# EAGLE design bluenrg-m2sa-to-dip (EAGLE 9.4.2)
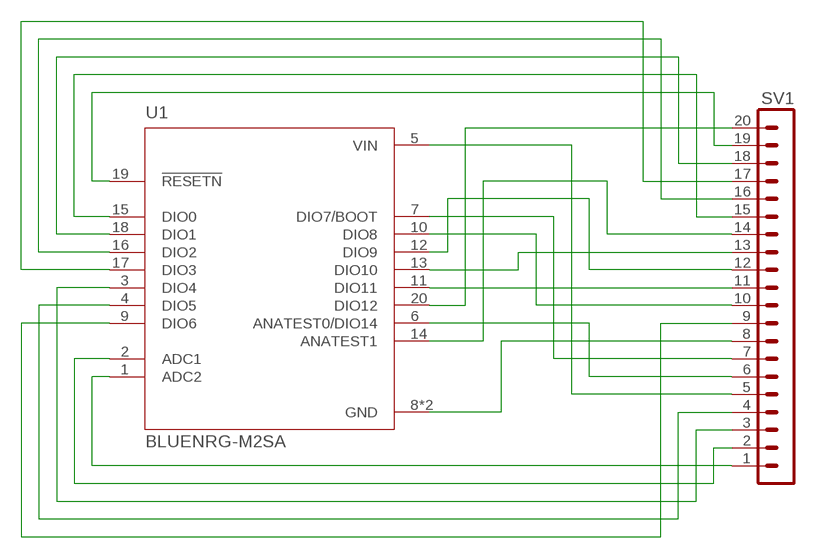
[diagram p0: schematic, sheet 1]

## Parts
SV1  MA20-1  [MA20-1]
U1  BLUENRG-M2SA  [XCVR_BLUENRG-M2SA]

## Nets
ADC1: SV1.2 U1.2(ADC1)
ADC2: SV1.1 U1.1(ADC2)
ANATEST0/DIO14: SV1.6 U1.6(ANATEST0/DIO14)
ANATEST1: SV1.14 U1.14(ANATEST1)
DIO0: SV1.15 U1.15(DIO0)
DIO1: SV1.18 U1.18(DIO1)
DIO2: SV1.16 U1.16(DIO2)
DIO3: SV1.17 U1.17(DIO3)
DIO4: SV1.3 U1.3(DIO4)
DIO5: SV1.4 U1.4(DIO5)
DIO6: SV1.9 U1.9(DIO6)
DIO7/BOOT: SV1.7 U1.7(DIO7/BOOT)
DIO8: SV1.10 U1.10(DIO8)
DIO9: SV1.12 U1.12(DIO9)
DIO10: SV1.13 U1.13(DIO10)
DIO11: SV1.11 U1.11(DIO11)
DIO12: SV1.20 U1.20(DIO12)
GND: SV1.8 U1.8(GND) U1.21(GND)
RESETN: SV1.19 U1.19(!RESETN)
VIN: SV1.5 U1.5(VIN)

## Library data of the parts
SV1 = con-lstb:MA20-1: PIN HEADER; OC_FARNELL: unknown; OC_NEWARK: unknown
U1 = BLUENRG-M2SA:BLUENRG-M2SA: Very low power application processor module for Bluetooth Low Energy; AVAILABILITY: Unavailable; DESCRIPTION: Very low power application processor module for Bluetooth Low Energy; MF: STMicroelectronics; MP: BLUENRG-M2SA; PACKAGE: None; PRICE: None

## Board
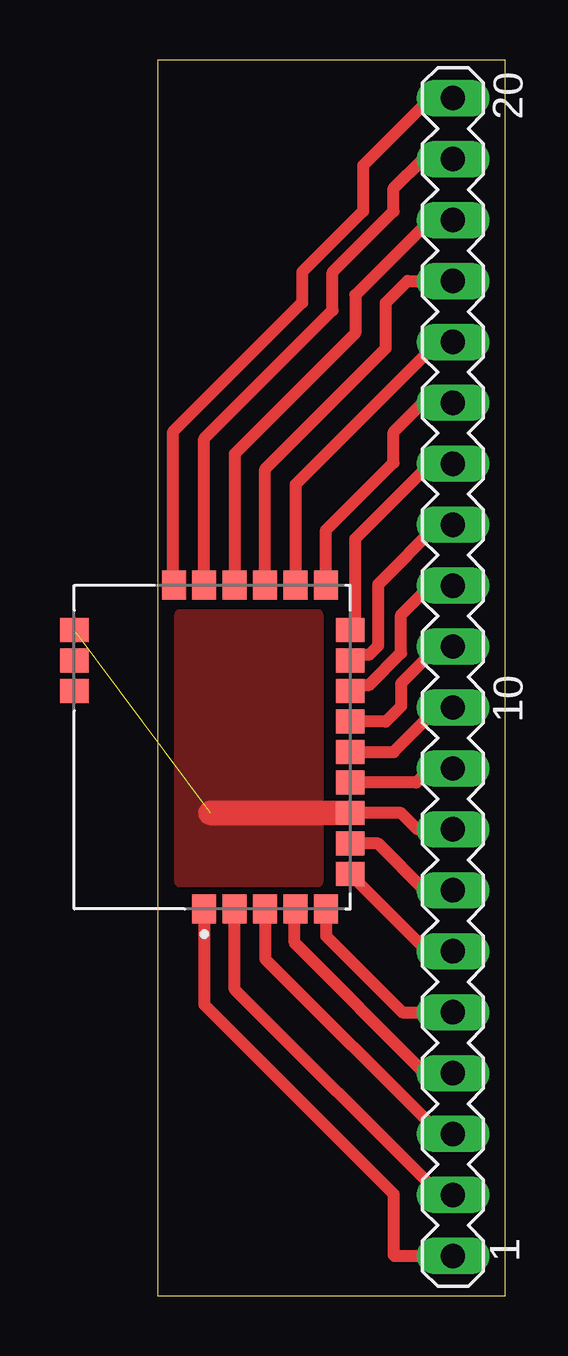
[diagram p1: board, top side]

Size 14.5 x 51.5 mm. Coordinates in mm from the lower left corner, seen from the top.
Outline: 0,0 14.5,0 14.5,51.5 0,51.5 0,0
Copper layers (1*16): Top 0.035mm / dielectric 1.5mm / Bottom 0.035mm
Design rules "default *": minimum track width 6mil, minimum drill 0.35mm, track to track 10mil, track to pad 10mil, pad to pad 10mil, via to via 10mil, smd to smd 6mil, copper to edge 10mil, drill to drill 6mil, minimum pad ring 10mil, minimum via ring 8mil, stop-mask expansion 4mil, vias tented up to drill 0mil, thermal gap 10mil

### Footprints (pad centres in the part's own frame; a part is rotated, then mirrored left to right if it is on the bottom)
MA20-1 = drill 1.016 long: 1 -24.13,0; 2 -21.59,0; 3 -19.05,0; 4 -16.51,0; 5 -13.97,0; 6 -11.43,0; 7 -8.89,0; 8 -6.35,0; 9 -3.81,0; 10 -1.27,0; 11 1.27,0; 12 3.81,0; 13 6.35,0; 14 8.89,0; 15 11.43,0; 16 13.97,0; 17 16.51,0; 18 19.05,0; 19 21.59,0; 20 24.13,0
XCVR_BLUENRG-M2SA = smd 1.2 x 1: 1 -11.62,1.27; 2 -11.62,0; 3 -11.62,-1.27; 4 -11.62,-2.54; 5 -11.62,-3.81; 15 1.88,-3.81; 16 1.88,-2.54; 17 1.88,-1.27; 18 1.88,0; 19 1.88,1.27; 20 1.88,2.54 | smd 1 x 1.2: 6 -10.16,-4.81; 7 -8.89,-4.81; 8 -7.62,-4.81; 9 -6.35,-4.81; 10 -5.08,-4.81; 11 -3.81,-4.81; 12 -2.54,-4.81; 13 -1.27,-4.81; 14 0,-4.81; 21 0,6.69; 22 -1.27,6.69; 23 -2.54,6.69

### Placement (x,y rotation side)
SV1  12.32,25.78 90 top
U1  3.22,27.73 90 top

### Tracks (layer width: path | path; a pad name or v marks a point on that pad's centre or on a via)
ADC1
  Top 0.508: SV1.2 11.79,4.19 3.22,12.76 U1.2
ADC2
  Top 0.508: U1.1 1.95,12.13 9.84,4.24 9.84,1.7 9.89,1.65 SV1.1
ANATEST0/DIO14
  Top 0.508: SV1.6 11.26,14.35 U1.6
ANATEST1
  Top 0.508: U1.14 8.26,27.95 8.26,31.54 11.38,34.67 SV1.14
DIO0
  Top 0.508: U1.15 7.03,31.91 9.84,34.72 9.84,35.99 11.06,37.21 SV1.15
DIO1
  Top 0.508: SV1.18 11.38,44.83 8.26,41.7 8.26,40.12 3.22,35.08 U1.18
DIO2
  Top 0.508: SV1.16 11.79,39.75 11.75,39.8 5.76,33.81 U1.16
DIO3
  Top 0.508: U1.17 4.49,34.45 9.53,39.48 9.53,41.38 10.43,42.29 SV1.17
DIO4
  Top 0.508: U1.3 4.49,14.03 11.79,6.73 SV1.3
DIO5
  Top 0.508: SV1.4 11.16,9.27 5.71,14.71 5.71,16.07 U1.4
DIO6
  Top 0.508: SV1.9 11.38,21.97 10.79,21.38 U1.9
DIO7/BOOT
  Top 0.508: SV1.7 11.16,16.89 9.21,18.84 U1.7
DIO8
  Top 0.508: U1.10 9.84,22.65 11.7,24.51 SV1.10
DIO9
  Top 0.508: U1.12 8.29,25.45 8.84,25.45 10.16,26.77 10.16,28.37 11.38,29.59 SV1.12
DIO10
  Top 0.508: U1.13 8.29,26.72 8.84,26.72 9.21,27.09 9.21,29.64 11.7,32.13 SV1.13
DIO11
  Top 0.508: SV1.11 11.7,27.05 10.16,25.51 10.16,24.56 9.53,23.92 U1.11
DIO12
  Top 0.508: SV1.20 11.48,49.91 11.43,49.96 8.57,47.1 8.57,45.2 6.03,42.66 6.03,41.38 0.64,35.99 0.64,29.66 U1.20
GND  (1 unrouted)
  Top 0.508: SV1.8 10.84,19.43 10.16,20.11 U1.8
  Top 1.016: U1.8 2.22,20.11
  pour Top: 0.95,28.37 6.67,28.37 6.67,17.25 0.95,17.25
RESETN
  Top 0.508: U1.19 1.95,35.72 7.3,41.07 7.3,42.66 9.84,45.2 9.84,46.15 11.06,47.37 SV1.19
VIN
  Top 0.508: U1.5 7.03,14.98 10.21,11.81 SV1.5

### Text on the board
Document: BlueNRG-M2SA | DIO12 | #RESETN | DIO1 | DIO3 | DIO2 | DIO0 | ANATEST1 | DIO10 (SWIO) | DIO9 (SWCLK) | DIO11 (RXD) | DIO8 (TXD) | DIO6 | GND | DIO7/BOOT | ANATEST0/DIO14 | VIN | DIO5 | DIO4 | ADC1 | ADC2 | 14.5 x 51.5 mm